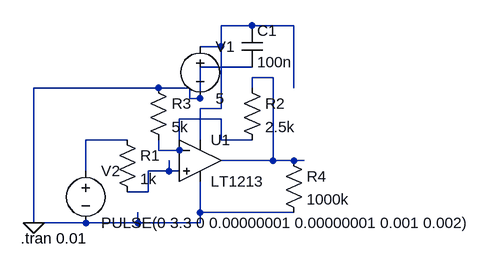
[diagram p0: schematic OpAmpVShift.asc]
OpAmpVShift.asc, the LTspice schematic file:
Version 4
SHEET 1 880 680
WIRE 320 16 272 16
WIRE 384 16 320 16
WIRE 272 48 272 16
WIRE 272 48 240 48
WIRE 320 80 240 80
WIRE 352 96 320 96
WIRE 176 112 -16 112
WIRE 224 112 176 112
WIRE 320 112 320 96
WIRE 384 112 384 16
WIRE 224 128 224 112
WIRE 240 128 240 80
WIRE 240 128 224 128
WIRE 272 144 272 48
WIRE 272 144 240 144
WIRE 272 160 208 160
WIRE 128 192 64 192
WIRE 240 192 240 144
WIRE 272 192 272 160
WIRE 320 192 272 192
WIRE 176 208 176 192
WIRE 208 208 208 160
WIRE 208 208 176 208
WIRE 352 224 352 96
WIRE 352 224 272 224
WIRE 384 224 352 224
WIRE 400 224 384 224
WIRE 64 240 64 192
WIRE 192 240 192 224
WIRE 192 240 160 240
WIRE 208 240 192 240
WIRE 160 272 160 240
WIRE 160 272 128 272
WIRE 240 304 240 256
WIRE 384 304 240 304
WIRE -16 320 -16 112
WIRE 64 320 -16 320
WIRE 144 320 144 304
WIRE 144 320 64 320
WIRE 240 320 240 304
WIRE 240 320 144 320
FLAG -16 320 0
SYMBOL voltage 240 32 R0
SYMATTR InstName V1
SYMATTR Value 5
SYMBOL voltage 64 224 R0
WINDOW 123 0 0 Left 2
WINDOW 39 0 0 Left 2
SYMATTR InstName V2
SYMATTR Value PULSE(0 3.3 0 0.00000001 0.00000001 0.001 0.002)
SYMBOL res 304 96 R0
SYMATTR InstName R2
SYMATTR Value 2.5k
SYMBOL res 160 96 R0
SYMATTR InstName R3
SYMATTR Value 5k
SYMBOL res 112 176 R0
SYMATTR InstName R1
SYMATTR Value 1k
SYMBOL res 368 208 R0
SYMATTR InstName R4
SYMATTR Value 1000k
SYMBOL cap 304 16 R0
SYMATTR InstName C1
SYMATTR Value 100n
SYMBOL Opamps\\LT1213 240 160 R0
SYMATTR InstName U1
TEXT -36 344 Left 2 !.tran 0.01

The netlist it stands for:
* OpAmpVShift.asc
V1 N001 0 5
V2 N004 0 PULSE(0 3.3 0 0.00000001 0.00000001 0.001 0.002)
R2 N002 N003 2.5k
R3 0 N003 5k
R1 N004 N005 1k
R4 N002 0 1000k
C1 N001 0 100n
XU1 N005 N003 N001 0 N002 LT1213  ; pins In+ In- V+ V- OUT
.tran 0.01
.lib LTC.lib
.backanno
.end